# EAGLE design FabScan-Shield_v15 (EAGLE 6.5.0)
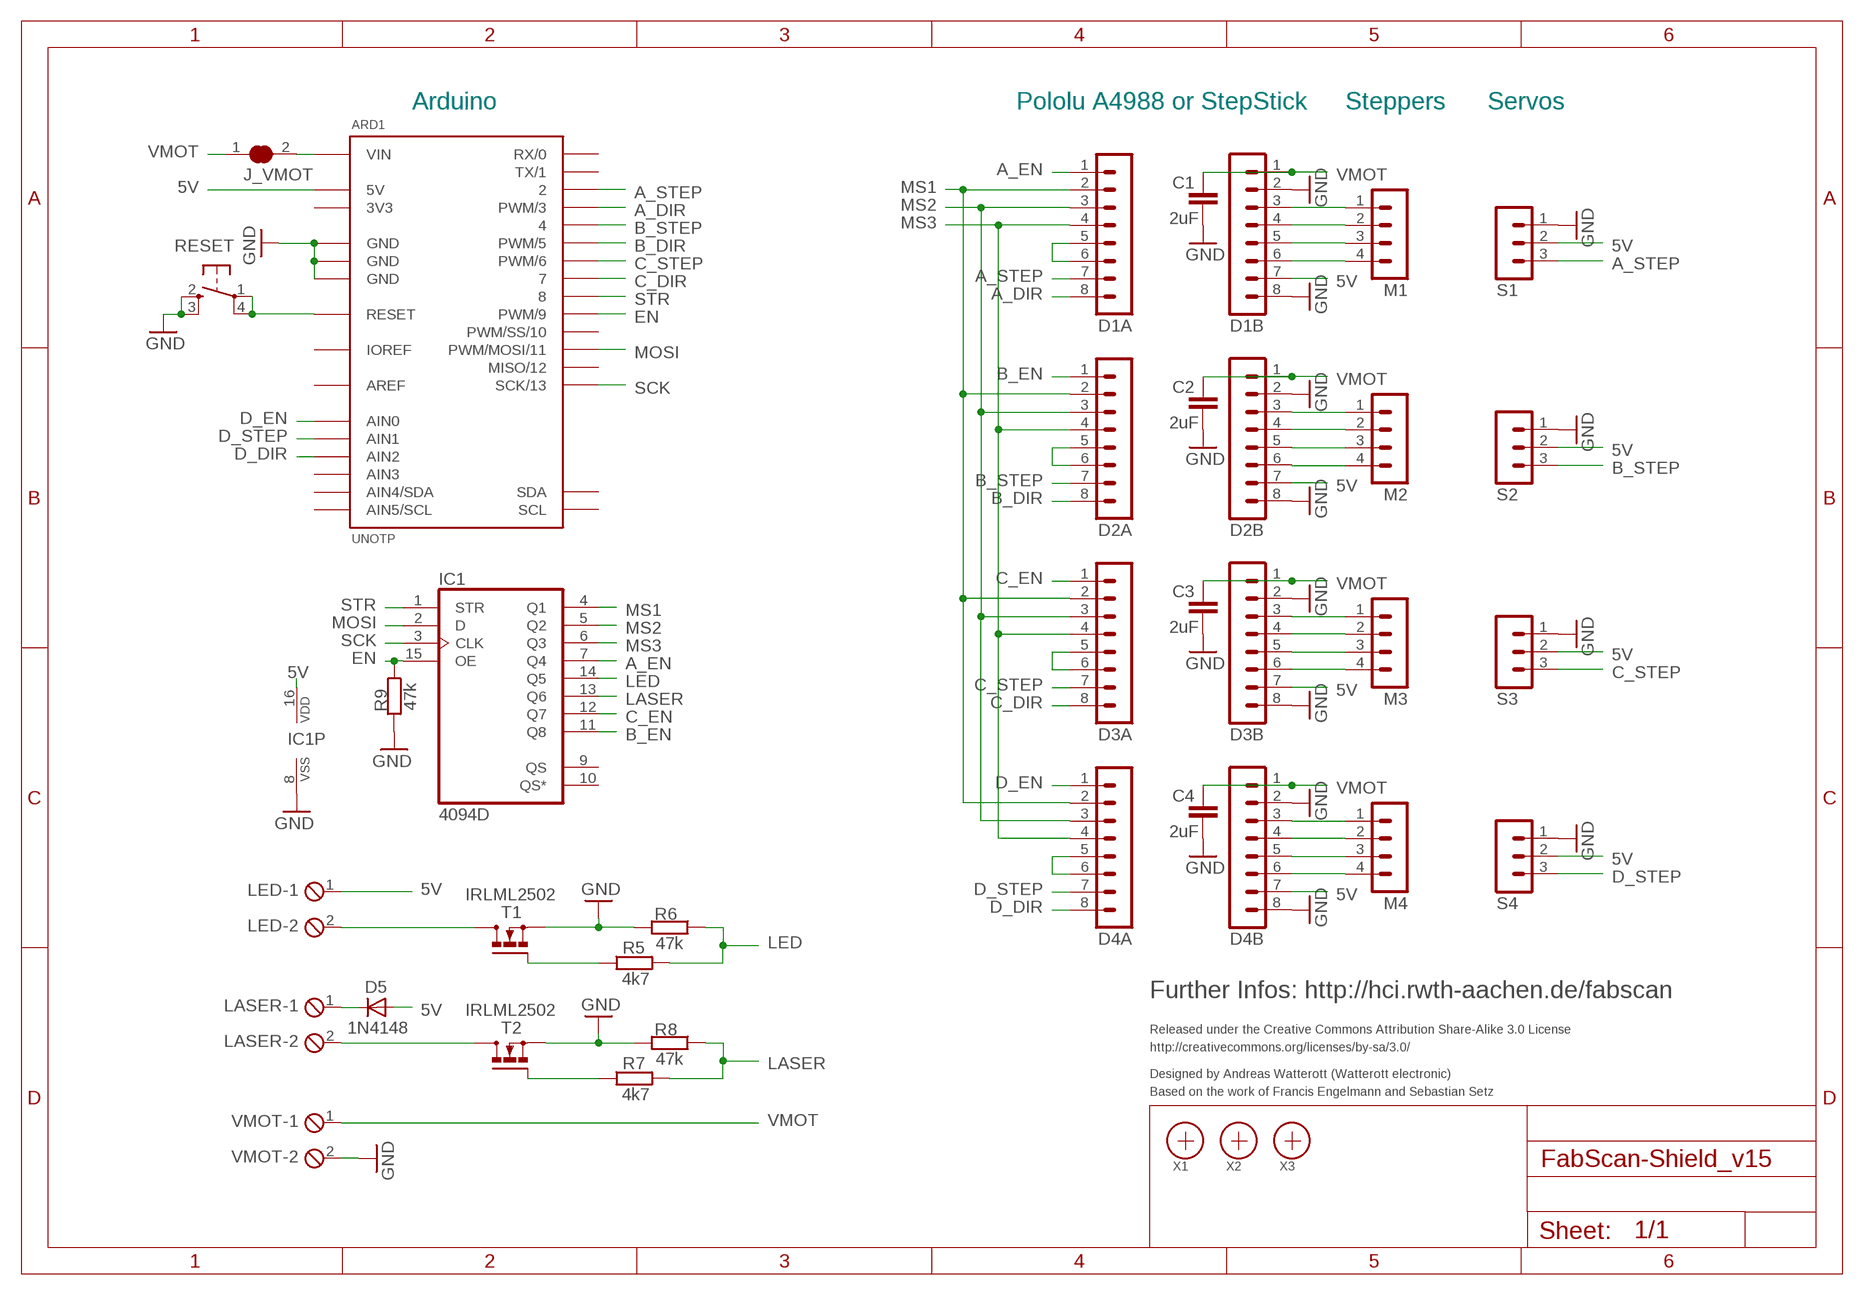
[diagram p0: schematic, sheet 1]

## Parts
ARD1  UNOTP  [UNOTP]
C1  2uF  C-EUC0603  [C0603]
C2  2uF  C-EUC0603  [C0603]
C3  2uF  C-EUC0603  [C0603]
C4  2uF  C-EUC0603  [C0603]
D1A  MA08-1  [MA08-1]
D1B  MA08-1  [MA08-1]
D2A  MA08-1  [MA08-1]
D2B  MA08-1  [MA08-1]
D3A  MA08-1  [MA08-1]
D3B  MA08-1  [MA08-1]
D4A  MA08-1  [MA08-1]
D4B  MA08-1  [MA08-1]
D5  1N4148  DIODE-SOD106-R  [SOD106-R]
IC1  4094D  [SO16]
J_VMOT  SJ  [SJ]
LASER  MPT2  [2POL254]
LED  MPT2  [2POL254]
M1  MA04-1  [MA04-1]
M2  MA04-1  [MA04-1]
M3  MA04-1  [MA04-1]
M4  MA04-1  [MA04-1]
R5  4k7  R-EU_R0603  [R0603]
R6  47k  R-EU_R0603  [R0603]
R7  4k7  R-EU_R0603  [R0603]
R8  47k  R-EU_R0603  [R0603]
R9  47k  R-EU_R0603  [R0603]
RESET  SW_SMDS  [SW_SMD4]
S1  MA03-1  [MA03-1]
S2  MA03-1  [MA03-1]
S3  MA03-1  [MA03-1]
S4  MA03-1  [MA03-1]
T1  IRLML2502  [MICRO3]
T2  IRLML2502  [MICRO3]
VMOT  MPT2  [2POL254]
X1  PASSER  [PASSER]
X2  PASSER  [PASSER]
X3  PASSER  [PASSER]

## Nets
5V: ARD1.5V D1B.7 D2B.7 D3B.7 D4B.7 D5.A IC1.16(VDD) LED.1 S1.2 S2.2 S3.2 S4.2
A_1A: D1B.5 M1.3
A_1B: D1B.6 M1.4
A_2A: D1B.4 M1.2
A_2B: D1B.3 M1.1
A_DIR: ARD1.3(PWM/3) D1A.8
A_EN: D1A.1 IC1.7(Q4)
A_RST: D1A.5 D1A.6
A_STEP: ARD1.2 D1A.7 S1.3
B_1A: D2B.5 M2.3
B_1B: D2B.6 M2.4
B_2A: D2B.4 M2.2
B_2B: D2B.3 M2.1
B_DIR: ARD1.5(PWM/5) D2A.8
B_EN: D2A.1 IC1.11(Q8)
B_STEP: ARD1.4 D2A.7 S2.3
C_1A: D3B.5 M3.3
C_1B: D3B.6 M3.4
C_2A: D3B.4 M3.2
C_2B: D3B.3 M3.1
C_DIR: ARD1.7 D3A.8
C_EN: D3A.1 IC1.12(Q7)
C_STEP: ARD1.6(PWM/6) D3A.7 S3.3
D_1A: D4B.5 M4.3
D_1B: D4B.6 M4.4
D_2A: D4B.4 M4.2
D_2B: D4B.3 M4.1
D_DIR: ARD1.AIN2 D4A.8
D_EN: ARD1.AIN0 D4A.1
D_STEP: ARD1.AIN1 D4A.7 S4.3
EN: ARD1.9(PWM/9) IC1.15(OE) R9.1
GND: ARD1.GND@1(GND) ARD1.GND@2(GND) ARD1.GND@3(GND) C1.2 C2.2 C3.2 C4.2 D1B.2 D1B.8 D2B.2 D2B.8 D3B.2 D3B.8 D4B.2 D4B.8 IC1.8(VSS) R6.2 R8.2 R9.2 RESET.2(S) RESET.3(S1) S1.1 S2.1 S3.1 S4.1 T1.2(S) T2.2(S) VMOT.2
LASER: IC1.13(Q6) R7.2 R8.1
LED: IC1.14(Q5) R5.2 R6.1
MOSI: ARD1.11(PWM/MOSI/11) IC1.2(D)
MS1: D1A.2 D2A.2 D3A.2 D4A.2 IC1.4(Q1)
MS2: D1A.3 D2A.3 D3A.3 D4A.3 IC1.5(Q2)
MS3: D1A.4 D2A.4 D3A.4 D4A.4 IC1.6(Q3)
N$1: LASER.2 T2.3(D)
N$5: D4A.5 D4A.6
N$6: LED.2 T1.3(D)
N$8: R5.1 T1.1(G)
N$9: R7.1 T2.1(G)
N$10: D5.C LASER.1
N$20: D2A.5 D2A.6
N$28: D3A.5 D3A.6
RST: ARD1.RST(RESET) RESET.1(P) RESET.4(P1)
SCK: ARD1.13(SCK/13) IC1.3(CLK)
STR: ARD1.8 IC1.1(STR)
VIN: ARD1.VIN J_VMOT.2
VMOT: C1.1 C2.1 C3.1 C4.1 D1B.1 D2B.1 D3B.1 D4B.1 J_VMOT.1 VMOT.1
Unconnected: ARD1.0(RX/0) ARD1.1(TX/1) ARD1.10(PWM/SS/10) ARD1.12(MISO/12) ARD1.AIN3 ARD1.AIN4(AIN4/SDA) ARD1.AIN5(AIN5/SCL) ARD1.SCL ARD1.SDA IC1.9(QS) IC1.10(QS*)

## Notes on the sheet
- Arduino | Pololu A4988 or StepStick | Steppers | Servos
- Further Infos: http://hci.rwth-aachen.de/fabscan
- Released under the Creative Commons Attribution Share-Alike 3.0 License
- http://creativecommons.org/licenses/by-sa/3.0/
- Designed by Andreas Watterott (Watterott electronic)
- Based on the work of Francis Engelmann and Sebastian Setz

## Power pins joined to a net without a drawn wire
3V3: ARD1.3V3
AREF: ARD1.AREF
IOREF: ARD1.IOREF

## Library data of the parts
ARD1 = Arduino:UNO: Arduino UNO
C1-C4 = rcl:C-EU: CAPACITOR, European symbol
D1A D1B D2A D2B D3A D3B D4A D4B = con-lstb:MA08-1: PIN HEADER; OC_FARNELL: unknown; OC_NEWARK: unknown
D5 = diode:DIODE-: DIODE
IC1 = 40xx:4094: 8-stage SHIFT/STORE REGISTER, tri-state
J_VMOT = jumper:SJ: SMD solder JUMPER
LASER LED VMOT = con-phoenix-254:MPT2: PHOENIX CONNECTOR; OC_FARNELL: unknown; OC_NEWARK: unknown
M1-M4 = con-lstb:MA04-1: PIN HEADER; OC_FARNELL: unknown; OC_NEWARK: unknown
R5-R9 = rcl:R-EU_: RESISTOR, European symbol
RESET = Switch-SMD:SW_SMD
S1-S4 = con-lstb:MA03-1: PIN HEADER; OC_FARNELL: unknown; OC_NEWARK: unknown
T1 T2 = IRF-sot23:IRLML2502: N-Channel Power MOSFET
X1-X3 = SMD:PASSER

## Board
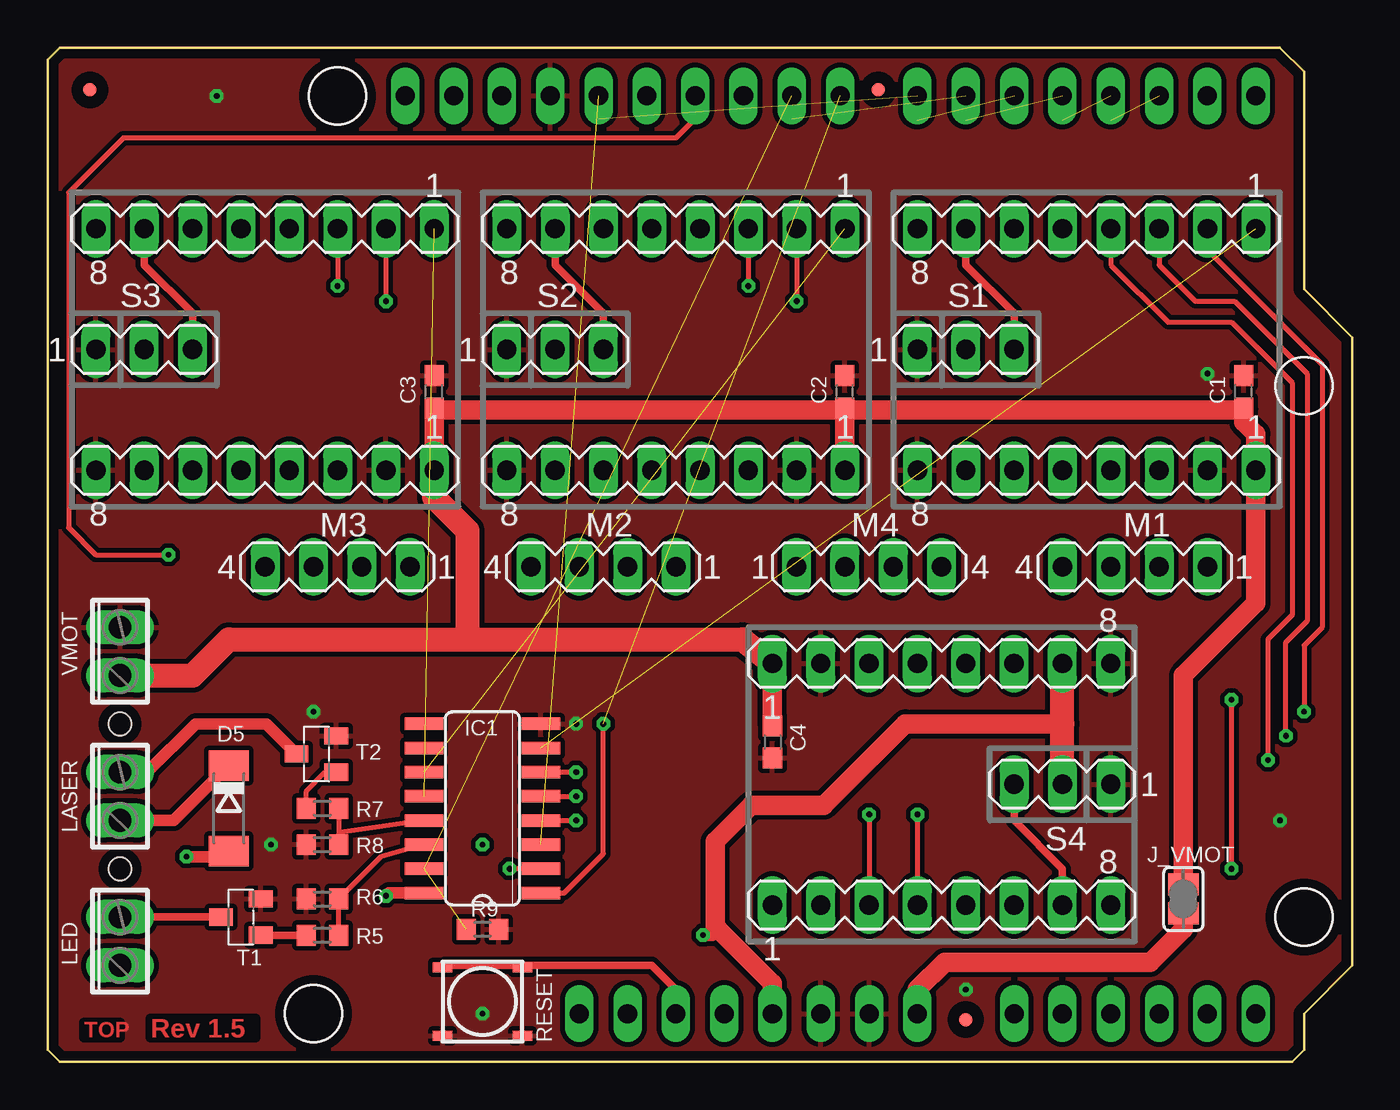
[diagram p1: board, top side]
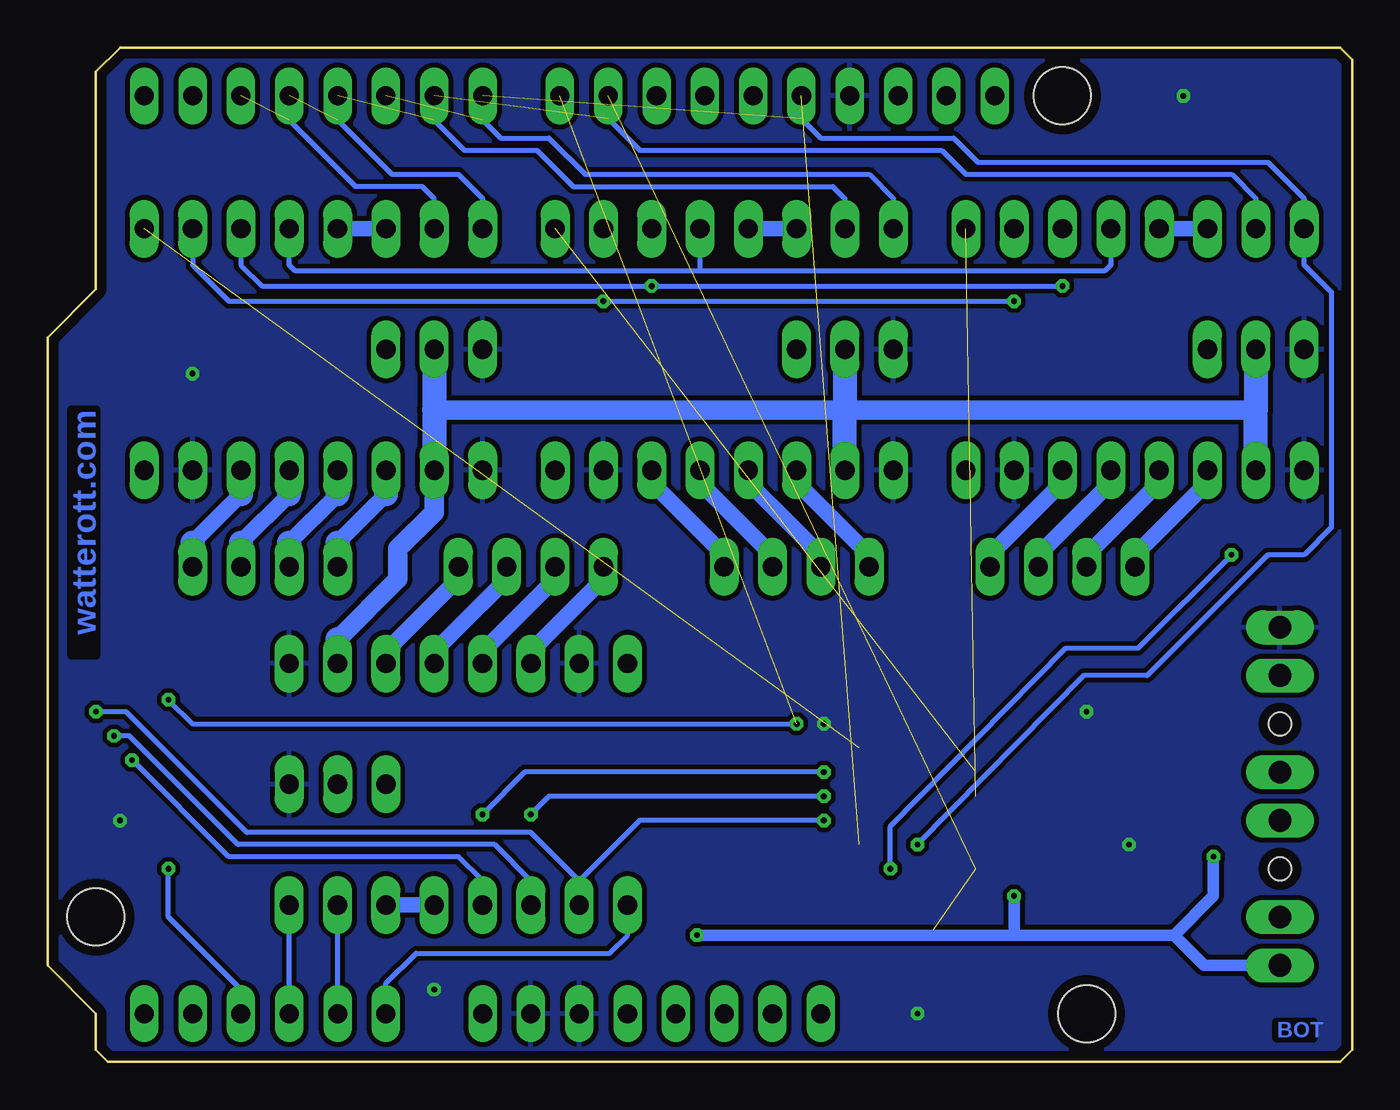
[diagram p2: board, bottom side, seen from below]

Size 68.58 x 53.34 mm. Coordinates in mm from the lower left corner, seen from the top.
Outline: 0.64,0 0,0.64 0,52.7 0.64,53.34 64.77,53.34 66.04,52.07 66.04,40.64 68.58,38.1 68.58,5.08 66.04,2.54 66.04,0.64 65.41,0 0.64,0
Copper layers (1*16): Top 0.035mm / dielectric 1.5mm / Bottom 0.035mm
Design rules "default *": minimum track width 8mil, minimum drill 0.3mm, track to track 8mil, track to pad 8mil, pad to pad 8mil, via to via 8mil, smd to smd 8mil, copper to edge 20mil, drill to drill 8mil, minimum pad ring 10mil, minimum via ring 8mil, stop-mask expansion 4mil, vias tented up to drill 0.5mm, thermal gap 10mil
Holes 1.2 mm at 3.81,10.16 3.81,17.78
Holes 3 mm at 15.24,50.8 13.97,2.54 66.04,7.62

### Footprints (pad centres in the part's own frame; a part is rotated, then mirrored left to right if it is on the bottom)
UNOTP = drill 1 long: 0 63.5,50.8; 1 60.96,50.8; 2 58.42,50.8; 3 55.88,50.8; 3V3 35.56,2.54; 4 53.34,50.8; 5 50.8,50.8; 5V 38.1,2.54; 6 48.26,50.8; 7 45.72,50.8; 8 41.656,50.8; 9 39.116,50.8; 10 36.576,50.8; 11 34.036,50.8; 12 31.496,50.8; 13 28.956,50.8; AIN0 50.8,2.54; AIN1 53.34,2.54; AIN2 55.88,2.54; AIN3 58.42,2.54; AIN4 60.96,2.54; AIN5 63.5,2.54; AREF 23.876,50.8; GND@1 40.64,2.54; GND@2 43.18,2.54; GND@3 26.416,50.8; IOREF 30.48,2.54; NC 27.94,2.54; RST 33.02,2.54; SCL 18.796,50.8; SDA 21.336,50.8; VIN 45.72,2.54
C0603 = smd 1.1 x 1: 1 -0.85,0; 2 0.85,0
MA08-1 = drill 1.016 long: 1 -8.89,0; 2 -6.35,0; 3 -3.81,0; 4 -1.27,0; 5 1.27,0; 6 3.81,0; 7 6.35,0; 8 8.89,0
SOD106-R = smd 1.6 x 2.1: A 2.25,0; C -2.25,0
SO16 = smd 0.66 x 2.032: 1 -4.445,-3.073; 2 -3.175,-3.073; 3 -1.905,-3.073; 4 -0.635,-3.073; 5 0.635,-3.073; 6 1.905,-3.073; 7 3.175,-3.073; 8 4.445,-3.073; 9 4.445,3.073; 10 3.175,3.073; 11 1.905,3.073; 12 0.635,3.073; 13 -0.635,3.073; 14 -1.905,3.073; 15 -3.175,3.073; 16 -4.445,3.073
SJ = smd 1.168 x 1.6: 1 -0.762,0; 2 0.762,0
2POL254 = drill 1.2 long: 1 -1.27,0; 2 1.27,0
MA04-1 = drill 1.016 long: 1 -3.81,0; 2 -1.27,0; 3 1.27,0; 4 3.81,0
R0603 = smd 1 x 1.1: 1 -0.85,0; 2 0.85,0
SW_SMD4 = smd 0.508 x 1.016: 1 -1.8,-2.1; 2 1.8,-2.1; 3 1.8,2.1; 4 -1.8,2.1
MA03-1 = drill 1.016 long: 1 -2.54,0; 2 0,0; 3 2.54,0
MICRO3 = smd 0.9 x 1.25: 1 -0.95,-1.05; 2 0.95,-1.05; 3 0,1.05
PASSER = smd 0.7 x 0.7: X 0,0

### Placement (x,y rotation side)
ARD1  0,0 0 top
C1  62.87,35.24 90 top
C2  41.91,35.24 90 top
C3  20.32,35.24 90 top
C4  38.1,16.83 270 top
D1A  54.61,43.81 180 top
D1B  54.61,31.11 180 top
D2A  33.02,43.81 180 top
D2B  33.02,31.11 180 top
D3A  11.43,43.81 180 top
D3B  11.43,31.11 180 top
D4A  46.99,8.26 0 top
D4B  46.99,20.95 0 top
D5  9.53,13.34 270 top
IC1  22.86,13.34 90 top
J_VMOT  59.69,8.57 270 top
LASER  3.81,13.97 90 top
LED  3.81,6.35 90 top
M1  57.15,26.04 180 top
M2  29.21,26.04 180 top
M3  15.24,26.04 180 top
M4  43.18,26.04 0 top
R5  14.45,6.67 0 top
R6  14.45,8.57 180 top
R7  14.45,13.34 0 top
R8  14.45,11.43 180 top
R9  22.86,6.99 0 top
RESET  22.86,3.17 270 top
S1  48.26,37.47 0 top
S2  26.67,37.47 0 top
S3  5.08,37.47 0 top
S4  53.34,14.61 180 top
T1  10.16,7.62 90 top
T2  14.13,16.19 90 top
VMOT  3.81,21.59 90 top
X1  2.22,51.12 0 top
X2  48.26,2.22 0 top
X3  43.66,51.12 0 top

### Tracks (layer width: path | path; a pad name or v marks a point on that pad's centre or on a via)
5V  (via drill 0.3)
  Top 0.254: IC1.16 18.89,8.89
  Top 0.61: 18.89,8.89 17.94,8.89 v17.78,8.73 | v34.45,6.67 34.92,6.67 35.24,6.99 | v7.3,10.79 9.23,10.79 D5.A
  Top 1.016: 53.34,17.78 45.09,17.78 40.8,13.49 36.99,13.49 35.08,11.59 35.08,7.14 35.24,6.99 38.1,4.13 ARD1.5V
  Top 1.27: S4.2 53.34,17.78 D4B.7
  Bottom 0.61: 17.78,6.67 v34.45,6.67 | v17.78,8.73 17.78,6.67 | LED.1 7.78,5.08 9.37,6.67 | 9.37,6.67 17.78,6.67 | 9.37,6.67 7.3,8.73 v7.3,10.79
  Bottom 1.016: 5.08,34.29 26.67,34.29 48.26,34.29 | 53.34,22.23 50.16,25.4 50.16,26.99 48.26,28.89 D1B.7
  Bottom 1.27: D3B.7 5.08,34.29 S3.2 | D1B.7 48.26,34.29 S1.2 | D2B.7 26.67,34.29 S2.2 | D4B.7 53.34,22.23
A_1A
  Bottom 0.813: 53.34,29.84 55.88,27.3
  Bottom 1.27: D1B.5 53.34,29.84 | 55.88,27.3 M1.3
A_1B
  Bottom 0.813: 50.8,29.84 53.34,27.3
  Bottom 1.27: D1B.6 50.8,29.84 | 53.34,27.3 M1.4
A_2A
  Bottom 0.813: 55.88,29.84 58.42,27.3
  Bottom 1.27: D1B.4 55.88,29.84 | 58.42,27.3 M1.2
A_2B
  Bottom 0.813: 58.42,29.84 60.96,27.3
  Bottom 1.27: D1B.3 58.42,29.84 | 60.96,27.3 M1.1
A_DIR  (1 unrouted)
  Bottom 0.254: D1A.8 45.72,45.4 46.99,46.67 50.48,46.67 53.34,49.53
A_EN  (1 unrouted)
A_RST
  Bottom 0.813: D1A.6 D1A.5
A_STEP  (1 unrouted)
  Top 0.406: D1A.7 48.26,41.91 50.8,39.37 S1.3
  Bottom 0.254: 55.88,49.53 52.39,46.04 48.9,46.04 48.26,45.4 D1A.7
B_1A
  Bottom 0.813: 31.75,30.48 27.94,26.67
  Bottom 1.27: D2B.5 31.75,30.48 | 27.94,26.67 M2.3
B_1B
  Bottom 0.813: 29.21,30.48 25.4,26.67
  Bottom 1.27: D2B.6 29.21,30.48 | 25.4,26.67 M2.4
B_2A
  Bottom 0.813: 34.29,30.48 30.48,26.67
  Bottom 1.27: D2B.4 34.29,30.48 | 30.48,26.67 M2.2
B_2B
  Bottom 0.813: 36.83,30.48 33.02,26.67
  Bottom 1.27: D2B.3 36.83,30.48 | 33.02,26.67 M2.1
B_DIR  (1 unrouted)
  Bottom 0.254: 45.72,49.53 44.77,48.58 42.23,48.58 40.32,46.67 25.4,46.67 24.13,45.4 D2A.8
B_EN  (1 unrouted)
B_STEP  (1 unrouted)
  Top 0.406: D2A.7 26.67,41.91 29.21,39.37 S2.3
  Bottom 0.254: 48.26,49.53 46.67,47.94 42.86,47.94 40.96,46.04 27.3,46.04 26.67,45.4 D2A.7
C_1A
  Bottom 0.813: 10.16,30.48 13.97,26.67
  Bottom 1.27: D3B.5 10.16,30.48 | 13.97,26.67 M3.3
C_1B
  Bottom 0.813: 7.62,30.48 11.43,26.67
  Bottom 1.27: D3B.6 7.62,30.48 | 11.43,26.67 M3.4
C_2A
  Bottom 0.813: 12.7,30.48 16.51,26.67
  Bottom 1.27: D3B.4 12.7,30.48 | 16.51,26.67 M3.2
C_2B
  Bottom 0.813: 15.24,30.48 19.05,26.67
  Bottom 1.27: D3B.3 15.24,30.48 | 19.05,26.67 M3.1
C_DIR  (via drill 0.3)  (1 unrouted)
  Bottom 0.254: 28.96,49.59 27.94,48.58 20.95,48.58 19.68,47.31 4.45,47.31 2.54,45.4 D3A.8 2.54,41.91 1.11,40.48 1.11,28.1 2.54,26.67 4.45,26.67 10.79,20.32 14.13,20.32 v22.86,11.43
C_EN  (1 unrouted)
C_STEP  (1 unrouted)
  Top 0.406: D3A.7 5.08,41.91 7.62,39.37 S3.3
  Bottom 0.254: D3A.7 5.08,45.4 6.35,46.67 20.32,46.67 21.59,47.94 37.47,47.94 39.12,49.59
D_1A
  Bottom 0.813: 48.26,21.59 44.45,25.4
  Bottom 1.27: D4B.5 48.26,21.59 | 44.45,25.4 M4.3
D_1B
  Bottom 0.813: 50.8,21.59 46.99,25.4
  Bottom 1.27: D4B.6 50.8,21.59 | 46.99,25.4 M4.4
D_2A
  Bottom 0.813: 45.72,21.59 41.91,25.4
  Bottom 1.27: D4B.4 45.72,21.59 | 41.91,25.4 M4.2
D_2B
  Bottom 0.813: 43.18,21.59 39.37,25.4
  Bottom 1.27: D4B.3 43.18,21.59 | 39.37,25.4 M4.1
D_DIR
  Bottom 0.254: ARD1.AIN2 D4A.8
D_EN
  Bottom 0.254: D4A.1 38.1,6.67 39.05,5.71 49.21,5.71 50.8,4.13 ARD1.AIN0
D_STEP
  Top 0.406: D4A.7 53.34,10.16 50.8,12.7 S4.3
  Bottom 0.254: ARD1.AIN1 D4A.7
EN  (2 unrouted)
GND  (via drill 0.3)
  other vias: 64.77,12.7 22.86,2.54 8.89,50.8 48.26,3.81 27.78,17.78 60.96,36.2 13.97,18.41 11.75,11.43
  pour Bottom (isolate 0.254): 0,53.34 68.58,53.34 68.58,0 0,0
  pour Top (isolate 0.254): 0,0 0,53.34 68.58,53.34 68.58,0
LASER
  Top 0.254: IC1.13 15.4,12.06 15.3,11.96 R8.1 R7.2
LED
  Top 0.254: R5.2 R6.1 17.52,10.79 IC1.14
MOSI  (via drill 0.3)
  Top 0.254: ARD1.11 34.04,49.59 33.02,48.58 3.97,48.58 1.11,45.72 1.11,28.1 2.54,26.67 v6.35,26.67 | IC1.2 v24.29,10.16
  Bottom 0.254: v6.35,26.67 11.27,21.75 15.08,21.75 24.29,12.38 v24.29,10.16
MS1  (via drill 0.3)
  Top 0.254: D2A.2 v39.37,40.01 | D3A.2 v17.78,40.01 | D1A.2 60.96,42.7 66.99,36.67 66.99,22.86 66.04,21.91 v66.04,18.41 | IC1.4 v27.78,12.7
  Bottom 0.254: D1A.2 60.96,41.91 59.05,40.01 v39.37,40.01 v17.78,40.01 | D4A.2 40.64,9.53 | 40.64,9.53 43.18,12.06 58.1,12.06 64.45,18.41 v66.04,18.41 | v27.78,12.7 37.47,12.7 40.64,9.53
MS2  (via drill 0.3)
  Top 0.254: D2A.3 v36.83,40.8 | D3A.3 v15.24,40.8 | D1A.3 58.42,41.91 60.33,40.01 62.39,40.01 66.2,36.2 66.2,23.18 65.09,22.07 v65.09,17.14 | IC1.5 v27.78,13.97 | v43.18,13.02 D4A.3
  Bottom 0.254: D1A.3 58.42,41.91 57.31,40.8 v36.83,40.8 v15.24,40.8 | D4A.3 43.18,9.53 45.09,11.43 58.58,11.43 64.29,17.14 v65.09,17.14 | v27.78,13.97 42.23,13.97 v43.18,13.02
MS3  (via drill 0.3)
  Top 0.254: D1A.4 55.88,41.91 58.9,38.89 62.23,38.89 65.41,35.72 65.41,23.5 64.14,22.23 v64.14,15.88 | IC1.6 v27.78,15.24 | v45.72,13.02 D4A.4
  Bottom 0.254: D3A.4 12.7,41.91 13.02,41.59 34.29,41.59 | 34.29,41.59 55.56,41.59 55.88,41.91 D1A.4 | D2A.4 34.29,41.59 | D4A.4 45.72,9.53 46.99,10.79 59.05,10.79 v64.14,15.88 | v27.78,15.24 43.5,15.24 v45.72,13.02
N$1
  Top 0.61: LASER.2 5.24,15.24 7.78,17.78 11.49,17.78 T2.3
N$5
  Bottom 0.813: D4A.6 D4A.5
N$6
  Top 0.406: T1.3 LED.2
N$8
  Top 0.254: R5.1
  Top 0.406: T1.1 R5.1
N$9
  Top 0.254: R7.1 13.6,14.23 14.61,15.24 T2.1
N$10
  Top 0.61: LASER.1 6.64,12.7 D5.C
N$13
  Top 0.61: 59.69,9.21 59.69,7.94
N$20
  Bottom 0.813: D2A.6 D2A.5
N$28
  Bottom 0.813: D3A.6 D3A.5
RST
  Top 0.406: 25.08,5.08 31.75,5.08 33.02,3.81 ARD1.RST | 25.08,5.08 25.07,5.08 | 25.07,5.08 RESET.4 24.98,4.97 25.08,5.08 | 25.07,5.08 20.86,5.08 RESET.1
SCK  (1 unrouted)
STR  (via drill 0.3)  (1 unrouted)
  Top 0.254: v62.23,10.16 v62.23,19.05 | IC1.1 27.15,8.89 29.21,10.95 v29.21,17.78
  Bottom 0.254: 58.42,3.81 62.23,7.62 v62.23,10.16 | v62.23,19.05 60.96,17.78 v29.21,17.78
VIN
  Top 1.016: ARD1.VIN 45.72,3.81 47.15,5.24 57.94,5.24 59.69,6.99 J_VMOT.2
VMOT
  Top 1.016: C4.1 D4B.1 | D3B.1 C3.1 20.42,34.29 41.91,34.29 | 41.91,34.29 C2.1 42.01,34.29 62.87,34.29 | 62.87,34.29 62.87,33.66 63.5,33.02 D1B.1 63.5,24.13 59.69,20.32 J_VMOT.1 | C1.1 62.87,34.29 | D2B.1 41.91,34.29
  Top 1.27: VMOT.1 7.62,20.32 9.53,22.23 22.07,22.23 | 22.07,22.23 36.51,22.23 D4B.1 | D3B.1 20.32,29.69 22.07,27.94 22.07,22.23

### Text on the board
Top: TOP | Rev 1.5
Bottom: watterott.com | BOT
tPlace: B-Druck: tDocu 51
tDocu: open | hardware | Dir | En | Dir | En | Dir | En | 3 | 2 | 1 | - | + | S | - | + | S | - | + | S | GND | VMot | GND | VMot | GND | VMot | GND | 1B 1A 2A 2B | 1B 1A 2A 2B | 2B 2A 1A 1B | 1B 1A 2A 2B | VMot | Power | VMot | GND | S | + | - | 4 | FabScan-Shield | GND | Laser | En | Dir | VMot-Vin | LED | 5V | Reset